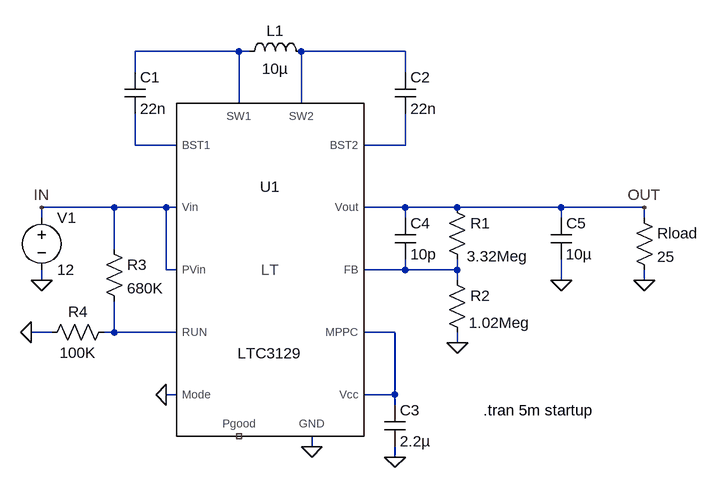
[diagram p0: schematic 3129.asc]
3129.asc, the LTspice schematic file:
Version 4
SHEET 1 880 680
WIRE 144 -112 -16 -112
WIRE 160 -112 144 -112
WIRE 400 -112 240 -112
WIRE -16 -80 -16 -112
WIRE 400 -80 400 -112
WIRE 144 -32 144 -112
WIRE 240 -32 240 -112
WIRE -16 32 -16 -16
WIRE 48 32 -16 32
WIRE 400 32 400 -16
WIRE 400 32 336 32
WIRE -48 128 -160 128
WIRE 32 128 -48 128
WIRE 48 128 32 128
WIRE 400 128 336 128
WIRE 480 128 400 128
WIRE 640 128 480 128
WIRE 768 128 640 128
WIRE -160 144 -160 128
WIRE 400 144 400 128
WIRE 640 144 640 128
WIRE 768 144 768 128
WIRE -48 192 -48 128
WIRE 32 224 32 128
WIRE 48 224 32 224
WIRE 400 224 400 208
WIRE 400 224 336 224
WIRE 480 224 480 208
WIRE 480 224 400 224
WIRE -160 240 -160 224
WIRE 480 240 480 224
WIRE 640 240 640 208
WIRE 768 240 768 224
WIRE -144 320 -176 320
WIRE -48 320 -48 272
WIRE -48 320 -64 320
WIRE 48 320 -48 320
WIRE 384 320 336 320
WIRE 480 336 480 320
WIRE 48 416 32 416
WIRE 384 416 384 320
WIRE 384 416 336 416
WIRE 384 432 384 416
WIRE 256 496 256 480
WIRE 384 512 384 496
FLAG 256 496 0
FLAG -160 240 0
FLAG 32 416 0
FLAG 384 512 0
FLAG 480 336 0
FLAG 640 240 0
FLAG 768 240 0
FLAG 768 128 OUT
FLAG -160 128 IN
FLAG -176 320 0
SYMBOL ind 144 -96 R270
WINDOW 0 32 56 VTop 2
WINDOW 3 5 56 VBottom 2
SYMATTR InstName L1
SYMATTR Value 10µ
SYMATTR SpiceLine Rser=20m
SYMBOL cap -32 -80 R0
SYMATTR InstName C1
SYMATTR Value 22n
SYMBOL cap 384 -80 R0
SYMATTR InstName C2
SYMATTR Value 22n
SYMBOL voltage -160 128 R0
SYMATTR InstName V1
SYMATTR Value 12
SYMBOL cap 368 432 R0
SYMATTR InstName C3
SYMATTR Value 2.2µ
SYMBOL res 464 112 R0
WINDOW 3 31 91 Left 2
SYMATTR Value 3.32Meg
SYMATTR InstName R1
SYMBOL res 464 224 R0
WINDOW 3 34 81 Left 2
SYMATTR Value 1.02Meg
SYMATTR InstName R2
SYMBOL cap 384 144 R0
SYMATTR InstName C4
SYMATTR Value 10p
SYMBOL res 752 128 R0
SYMATTR InstName Rload
SYMATTR Value 25
SYMBOL cap 624 144 R0
WINDOW 3 23 56 Left 2
SYMATTR Value 10µ
SYMATTR SpiceLine Rser=1m
SYMATTR InstName C5
SYMBOL res -64 176 R0
SYMATTR InstName R3
SYMATTR Value 680K
SYMBOL res -48 304 R90
WINDOW 0 0 56 VBottom 2
WINDOW 3 32 56 VTop 2
SYMATTR InstName R4
SYMATTR Value 100K
SYMBOL LTC3129 192 224 R0
SYMATTR InstName U1
TEXT 520 440 Left 2 !.tran 5m startup

The netlist it stands for:
* 3129.asc
L1 N001 N002 10µ Rser=20m
C1 N001 N003 22n
C2 N002 N004 22n
V1 IN 0 12
C3 N007 0 2.2µ
R1 OUT N005 3.32Meg
R2 N005 0 1.02Meg
C4 OUT N005 10p
Rload OUT 0 25
C5 OUT 0 10µ Rser=1m
R3 IN N006 680K
R4 N006 0 100K
XU1 0 N003 N001 IN IN N006 N007 N007 N005 N004 0 N002 NC_01 OUT LTC3129  ; pins GND BST1 SW1 PVin Vin RUN Vcc MPPC FB BST2 Mode SW2 Pgood Vout
.tran 5m startup
.lib LTC3129.sub
.backanno
.end